# Altium schematic sheet E1811SENSE_0.SchDoc
size B; SheetNumber: 1; SheetTotal: 2
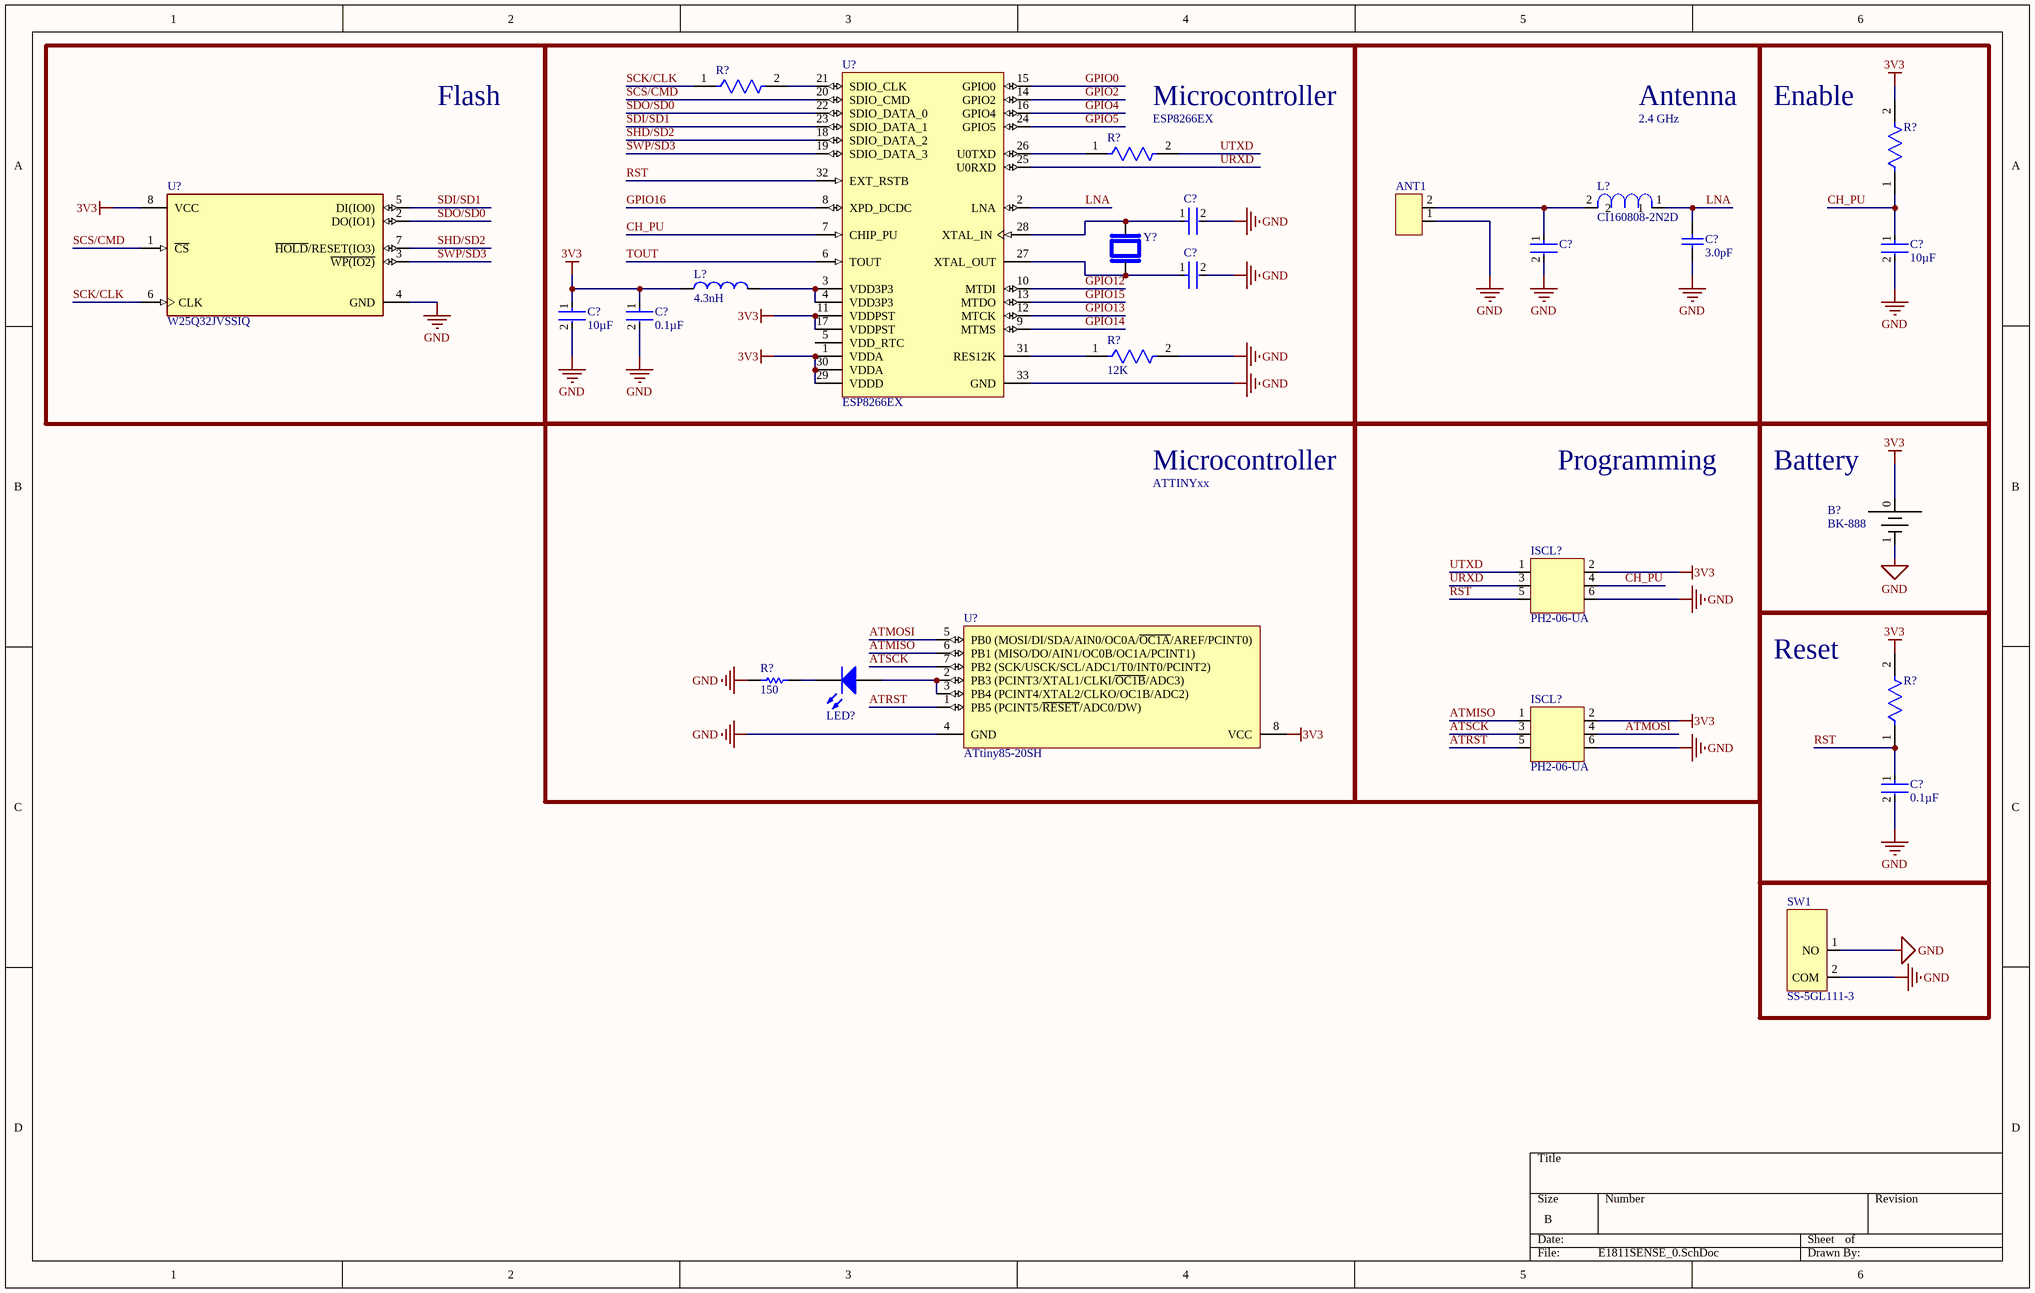
[diagram p0: E1811SENSE_0.SchDoc]

## Parts
(Parts that share a designator on the sheet are numbered #1, #2 ... from top to bottom, then left to right.)
ANT1  2.4GHZ_Antenna  [2.54GHZ_Antenna]  (value not drawn)
B?  BK-888  [BK-888]
C?#1  C0603C689B5GACAUTO  [FP-C0603C-CF-MFG]  (value not drawn)
C?#2  CBR06C249B5GAC  [FP-CBR06C-MFG]  (value not drawn)
C?#3  10µF  [FP-CGB3S-MFG]
C?#4  3.0pF  [CAPC1608X90X35NL10T15]
C?#5  C0603C689B5GACAUTO  [FP-C0603C-CF-MFG]  (value not drawn)
C?#6  10µF  [FP-CGB3S-MFG]
C?#7  0.1µF  [FP-CGA3E-0_3-0_1-MFG]
C?#8  0.1µF  [FP-CGA3E-0_3-0_1-MFG]
ISCL?#1  PH2-06-UA  [PH2-06-UA]
ISCL?#2  PH2-06-UA  [PH2-06-UA]
L?#1  CI160808-2N2D  [INDC1608X08N]
L?#2  4.3nH  [INDC1005X55N]
LED?  L513SRD-A  [L513SRD-A]  (value not drawn)
R?#1  RT0603FRE07200RL  [FP-RT0603-MFG]  (value not drawn)
R?#2  499  [FP-RT0603-MFG]  (value not drawn)
R?#3  AC0603FR-0710KL  [FP-AC0603-MFG]  (value not drawn)
R?#4  12K  [FP-RT0603-MFG]
R?#5  150  [RESC2012N]
R?#6  AC0603FR-0710KL  [FP-AC0603-MFG]  (value not drawn)
SW1  SS-5GL111-3  [SS-5GL1131-3]
U?#1  ESP8266EX  [ESFS-QFN-32_L]
U?#2  W25Q32JVSSIQ  [FP-SS-MFG]
U?#3  ATtiny85-20SH  [8S2_L]
Y?  XRCGB26M000F1H02R0  [OSC_XRCGB26M000F1H02R0]  (value not drawn)

## Blocks framed on the sheet
Flash: U?#2
Microcontroller: C?#1 C?#5-C?#7 L?#2 R?#1 R?#2 R?#4 U?#1 Y?
Antenna: ANT1 C?#2 C?#4 L?#1
Enable: C?#3 R?#3
Microcontroller: LED? R?#5 U?#3
Programming: ISCL?#1 ISCL?#2
Battery: B?
Reset: C?#8 R?#6

## Nets
3V3: B?.0(+) C?#6.1 C?#7.1 ISCL?#1.2 ISCL?#2.2 L?#2.1 R?#3.2 R?#6.2 U?#1.1(VDDA) U?#1.11(VDDPST) U?#1.17(VDDPST) U?#1.29(VDDD) U?#1.30(VDDA) U?#2.8(VCC) U?#3.8(VCC)
GND: ANT1.1 B?.1(Neg) C?#1.2 C?#2.2 C?#3.2 C?#4.1 C?#5.2 C?#6.2 C?#7.2 C?#8.2 ISCL?#1.6 ISCL?#2.6 R?#4.2 R?#5.1 SW1.1(NO) SW1.2(COM) U?#1.33(GND) U?#2.4(GND) U?#3.4(GND)
ATMISO: ISCL?#2.1 U?#3.6(PB1_(MISO/DO/AIN1/OC0B/OC1A/PCINT1))
ATMOSI: ISCL?#2.4 U?#3.5(PB0_(MOSI/DI/SDA/AIN0/OC0A/~{OC1A}/AREF/PCINT0))
ATRST: ISCL?#2.5 U?#3.1(PB5_(PCINT5/~{RESET}/ADC0/DW))
ATSCK: ISCL?#2.3 U?#3.7(PB2_(SCK/USCK/SCL/ADC1/T0/INT0/PCINT2))
CH_PU: C?#3.1 ISCL?#1.4 R?#3.1 U?#1.7(CHIP_PU)
GPIO0: U?#1.15(GPIO0)
GPIO2: U?#1.14(GPIO2)
GPIO4: U?#1.16(GPIO4)
GPIO5: U?#1.24(GPIO5)
GPIO12: U?#1.10(MTDI)
GPIO13: U?#1.12(MTCK)
GPIO14: U?#1.9(MTMS)
GPIO15: U?#1.13(MTDO)
GPIO16: U?#1.8(XPD_DCDC)
LNA: C?#4.2 L?#1.1 U?#1.2(LNA)
RST: C?#8.1 ISCL?#1.5 R?#6.1 U?#1.32(EXT_RSTB)
SCK/CLK: R?#1.1 U?#2.6(CLK)
SCS/CMD: U?#1.20(SDIO_CMD) U?#2.1(~{CS})
SDI/SD1: U?#1.23(SDIO_DATA_1) U?#2.5(DI(IO0))
SDO/SD0: U?#1.22(SDIO_DATA_0) U?#2.2(DO(IO1))
SHD/SD2: U?#1.18(SDIO_DATA_2) U?#2.7(~{HOLD}/RESET(IO3))
SWP/SD3: U?#1.19(SDIO_DATA_3) U?#2.3(~{WP(IO2)})
TOUT: U?#1.6(TOUT)
URXD: ISCL?#1.3 U?#1.25(U0RXD)
UTXD: ISCL?#1.1 R?#2.2
NetANT1_2: ANT1.2 C?#2.1 L?#1.2
NetC?#1_1: C?#1.1 U?#1.28(XTAL_IN) Y?.3
NetC?#5_1: C?#5.1 U?#1.27(XTAL_OUT) Y?.1
NetL?#2_2: L?#2.2 U?#1.3(VDD3P3) U?#1.4(VDD3P3)
NetLED?_1: LED?.1 R?#5.2
NetLED?_2: LED?.2 U?#3.2(PB3_(PCINT3/XTAL1/CLKI/~{OC1B}/ADC3)) U?#3.3(PB4_(PCINT4/XTAL2/CLKO/OC1B/ADC2))
NetR?#1_2: R?#1.2 U?#1.21(SDIO_CLK)
NetR?#2_1: R?#2.1 U?#1.26(U0TXD)
NetR?#4_1: R?#4.1 U?#1.31(RES12K)

Not connected (* = marked no-connect by the designer): U?#1 5(VDD_RTC)

## Notes on the sheet
- (near R?#2) ESP8266EX
- 2.4 GHz
- ATTINYxx

## Library data of the parts
B? = BK-888: BATTERY RETAINER COIN PC PIN; Manufacturer: Memory Protection Devices; Number of Cells: 1; Supplier 1: Digi-Key; Supplier Part Number 1: BK-888-ND; Manufacturer Part Number: BK-888; RoHS: Yes; Category: Uncategorized; Stock 1: 16752; Pricing 1: 1=0.47000, 10=0.39900, 50=0.35040, 100=0.33050, 250=0.30448, 500=0.28612, 1000=0.26775, 2500=0.24327, 5000=0.22644 (USD); Mount: Through Hole,PCB; Package Quantity: 100; Termination: PC Pin; ComponentLink1URL: https://datasheet.ciiva.com/4/bk-888-datasheet-4054.pdf?src-supplier=Digi-Key; ComponentLink1Description: https://datasheet.ciiva.com/4/bk-888-datasheet-4054.pdf?src-supplier=Digi-Key
C?#1 C?#5 = CMP-03020-012605-1: C0603 6.8 pF C0G 30ppm/°C 0.1 pF 50 V; Manufacturer: KEMET; Voltage Rating: 50 V; Tolerance: 0.1 pF; Value: 6.8 pF; Material: Ceramic; Automotive Grade: Grade 1; Temperature Characteristic: C0G; ComponentLink2URL: https://api.kemet.com/component-edge/download/datasheet/C0603C100J5GACAUTO.pdf; Device Class L2: Capacitors; Device Class L1: Passive Components; RoHS: TRUE; Height: 0.87mm; Temperature Coefficient: 30ppm/°C; Octopart: https://octopart.com/c0603c689b5gacauto-kemet-88370509; Temperature: -55°C to +125°C; Temperature Range High: +125°C; Automotive: Yes; Temperature Range Low: -55°C; Device Class L3: Ceramic Capacitors; ComponentLink2Description: Datasheet; Category: Cap; Capacitance: 6.8 pF; Manufacturer Part Number: C0603C689B5GACAUTO; Package: C0603C-CF; Lead Free: Yes
C?#2 = CMP-03020-011865-1: CBR0603 2.4 pF C0G 30ppm/°C 0.1 pF 50 V; Manufacturer: KEMET; Material: Ceramic; Capacitance: 2.4 pF; Value: 2.4 pF; Voltage Rating: 50 V; Tolerance: 0.1 pF; Temperature Characteristic: C0G; Temperature Range Low: -55°C; Device Class L1: Passive Components; Device Class L2: Capacitors; Category: Cap; Height: 0.87mm; Temperature Range High: +125°C; Lead Free: Yes; Device Class L3: Ceramic Capacitors; ComponentLink2Description: Datasheet; Manufacturer Part Number: CBR06C249B5GAC; ComponentLink2URL: https://content.kemet.com/datasheets/KEM_C1030_CBR_SMD.pdf; Octopart: https://octopart.com/cbr06c249b5gac-kemet-84758721; Temperature: -55°C to +125°C; RoHS: TRUE; Temperature Coefficient: 30ppm/°C; Automotive: No; Package: CBR06C; Ipc Land Pattern Name: CAPC16080X80
C?#3 C?#6 = CMP-08246-002672-1: CAP CER 10UF 4V X5R 0603 / CGB3S3X5R0G106M050AB; Tolerance: 20%; Max Operating Temperature: 85°C; Length: 0.063inch; Case Code (Imperial): 0603; RoHS Compliant: Yes; Width: 0.031inch; Thickness: 0.02inch; Voltage Rating: 4V; Min Operating Temperature: -55°C; Mount: Surface Mount; Capacitance: 10uF; Package Quantity: 4000; Case/Package: 0603; Packaging: Tape and Reel; Case Code (Metric): 1608
C?#4 = CMP-2006-02541-1: GRM1885C1H3R0BA01D; Manufacturer: Murata; Part Number: GRM1885C1H3R0BA01D
C?#7 C?#8 = CMP-08246-002186-1: Cap Ceramic 100nF 25V X7R 10% Pad SMD 0603 +125°C Automotive T/R / CGA3E2X7R1E104K080AA; Composition: Ceramic; Dielectric: X7R; Ratings: AEC-Q200; Length: 1.6mm; REACH SVHC: No SVHC; Width: 0.031inch; Packaging: Tape and Reel; Case/Package: 0603; Height: 0.8mm; Termination: SMD/SMT; Max Operating Temperature: 125°C; Thickness: 0.035inch; Case Code (Metric): 1608; Lead Free: Lead Free; Mount: Surface Mount; Voltage Rating (DC): 25V; Capacitance: 100nF; Voltage Rating: 25V; Tolerance: 10%; Weight: 7.1E-05oz; Min Operating Temperature: -55°C; Package Quantity: 1; Depth: 0.8mm; Case Code (Imperial): 0603
L?#1 = CI160808-2N2D: CHIP INDUCTOR, 2.2NH, 300MA 0.3NH, 10GHZ; MF: {'manufacturer': u'Bourns'}; MP: CI160808-2N2D; Price: None; Availability: Unavailable; Package: None; Value: *
L?#2 = MLG1005S4N3ST000: MF: {'manufacturer': u'TDK'}; Package: None; MP: MLG1005S4N3ST000; Value: *; Availability: Unavailable; Price: None
R?#1 = CMP-2000-04682-2: RES SMD 200 OHM 1% 1/10W 0603; Manufacturer: Yageo; Temperature Coefficient: 50 ppm/°C; Tolerance: 0.01; Value: 200Ω; Voltage Rating: 75V; Power Rating: 0.1W; Height: 0.55mm; Automotive: No; ComponentLink2URL: http://www.yageo.com/documents/recent/PYu-RT_1-to-0.01_RoHS_L_9.pdf; Temperature Range High: +155°C; Package: RT0603; Series: RT; Device Class L3: Chip SMD Resistors; ComponentLink2Description: Datasheet; Lead Free: Yes; Octopart: https://octopart.com/rt0603fre07200rl-yageo-1160531; Temperature: -55°C to +155°C; Device Class L2: Resistors; Temperature Range Low: -55°C; RoHS: TRUE; Footprint Url: http://www.yageo.com/exep/pages/download/literatures/PYu-R_Mount_10.pdf; Manufacturer Part Number: RT0603FRE07200RL; Device Class L1: Passive Components; Composition: Thin Film; Ipc Land Pattern Name: RESC16080X45; Category: Res; Digikey Description: RES SMD 200 OHM 1% 1/10W 0603; Mouser Description: Res Thin Film 0603 200 Ohm 1% 0.1W(1/10W) ±50ppm/C Epoxy Pad SMD T/R; Resistance: 200Ω
R?#2 = CMP-03412-028276-1: RES SMD 499 OHM 0.1% 1/10W 0603 / RT0603BRC07499RL; Manufacturer: Yageo; Temperature Coefficient: 15 ppm/°C; Voltage Rating: 75V; Power Rating: 0.1W; Resistance: 499Ω; Value: 499Ω; Tolerance: 0.001; Footprint Url: http://www.yageo.com/exep/pages/download/literatures/PYu-R_Mount_10.pdf; ComponentLink2Description: Datasheet; Series: RT; Height: 0.55mm; Digikey Description: RES SMD 499 OHM 0.1% 1/10W 0603; Manufacturer Part Number: RT0603BRC07499RL; Automotive: No; Octopart: https://octopart.com/rt0603brc07499rl-yageo-71394139; Lead Free: Yes; Temperature Range High: +155°C; Device Class L3: Chip SMD Resistors; ComponentLink2URL: http://www.yageo.com/documents/recent/PYu-RT_1-to-0.01_RoHS_L_9.pdf; Category: Res; Temperature: -55°C to +155°C; Composition: Thin Film; Package: RT0603; Device Class L1: Passive Components; Device Class L2: Resistors; Ipc Land Pattern Name: RESC16080X45; RoHS: TRUE; Temperature Range Low: -55°C
R?#3 R?#6 = CMP-2000-04818-2: RES SMD 10K OHM 1% 1/10W 0603; Manufacturer: Yageo; Value: 10KΩ; Automotive Grade: Grade 0; Tolerance: 0.01; Power Rating: 0.1W; Voltage Rating: 75V; Automotive: Yes; Device Class L2: Resistors; Device Class L1: Passive Components; Footprint Url: http://www.yageo.com/exep/pages/download/literatures/PYu-R_Mount_9.pdf; Temperature Range High: +155°C; Composition: Thick Film; Height: 0.55mm; Series: AC; Mouser Description: Fixed Resistor, Metal Glaze/thick Film, 0.1W, 10000ohm, 50V, 1% +/-Tol, 100ppm/Cel, Surface Mount, 0603; RoHS: TRUE; Manufacturer Part Number: AC0603FR-0710KL; Lead Free: Yes; Package: AC0603; Ipc Land Pattern Name: RESC16080X45; Octopart: https://octopart.com/ac0603fr-0710kl-yageo-21711091; ComponentLink2URL: http://www.yageo.com/NewPortal/yageodocoutput?fileName=/pdf/R-Chip/PYu-AC_51_RoHS_L_6.pdf; Digikey Description: RES SMD 10K OHM 1% 1/10W 0603; Temperature Range Low: -55°C; Temperature: -55°C to +155°C; ComponentLink2Description: Datasheet; Category: Res; Resistance: 10KΩ; Device Class L3: Chip SMD Resistors
R?#4 = CMP-03412-012603-1: RES SMD 12K OHM 1% 1/10W 0603 / RT0603FRE0712KL; Manufacturer: Yageo; Temperature Coefficient: 50 ppm/°C; Value: 12KΩ; Tolerance: 0.01; Power Rating: 0.1W; Voltage Rating: 75V; Temperature Range Low: -55°C; Height: 0.55mm; ComponentLink2Description: Datasheet; Package: RT0603; Composition: Thin Film; Device Class L2: Resistors; Footprint Url: http://www.yageo.com/exep/pages/download/literatures/PYu-R_Mount_10.pdf; Temperature Range High: +155°C; Resistance: 12KΩ; ComponentLink2URL: http://www.yageo.com/documents/recent/PYu-RT_1-to-0.01_RoHS_L_9.pdf; Automotive: No; Digikey Description: RES SMD 12K OHM 1% 1/10W 0603; Device Class L1: Passive Components; Temperature: -55°C to +155°C; Lead Free: Yes; Category: Res; Series: RT; Ipc Land Pattern Name: RESC16080X45; Manufacturer Part Number: RT0603FRE0712KL; Device Class L3: Chip SMD Resistors; RoHS: TRUE; Mouser Description: Thin Film Resistors - SMD 1/10W 12K ohm 1% 50ppm; Octopart: https://octopart.com/rt0603fre0712kl-yageo-40002015
R?#5 = Res_150_0805: RES 150 OHM 1/8W 1% 0805; Manufacturer: Vishay; Manufacturer P/N: CRCW0805150RFKEA; Power Rating: 125mW; Resistance: 150R; Voltage Rating: 150V; Temperature Coefficient: 100ppm/°C; Supplier 1: Digi-Key; Supplier Part Number 1: 541-150CCT-ND; Mount: Surface Mount; Case/Package: 0805; Weight: 0.000194oz; Case Code (Metric): 2012; Case Code (Imperial): 0805; Contact Plating: Tin; Min Operating Temperature: -55°C; Max Operating Temperature: 155°C; Tolerance: 1%; Package Quantity: 10; Composition: Thick Film; Termination: SMD/SMT; Max Power Dissipation: 125mW; Voltage Rating (DC): 150V; Features: Automotive AEC-Q200; Military Standard: Not; Length: 2mm; Height: 0.45mm; Width: 0.049inch; Depth: 1.25mm; Radiation Hardening: No; Lead Free: Lead Free; REACH SVHC: Unknown; ComponentLink3URL: http://www.vishay.com/docs/20035/dcrcwe3.pdf; ComponentLink3Description: http://www.vishay.com/docs/20035/dcrcwe3.pdf
U?#1 = CMP-2000-07453-1: Low-Power, Highly-Integrated Wi-Fi Solution, 2.5 to 3.6 V, 80 mA, -40 to 125 degC, 32-Pin QFN; Manufacturer: Espressif Systems; Mounting Technology: SurfaceMount; Datasheet URL: http://espressif.com/sites/default/files/documentation/0a-esp8266ex_datasheet_en.pdf; Package Reference: QFN-32; Package Description: 32-Pin Quad Falt No-Lead, Body 5 x 5 mm, Pitch 0.5 mm; Manufacturer URL: http://espressif.com; Datasheet Version: Rev. 5.4, 04/2017
U?#2 = CMP-2000-05006-2: IC FLASH 32M SPI 104MHZ 8SOIC; Manufacturer: Winbond; Manufacturer Part Number: W25Q32FVSSIG; Obsolete Part: true; Access Time: 7ns; Nominal Supply Current: 8-20mA; Memory Size: 32Mbits; Max Supply Voltage: 3.6V; Min Supply Voltage: 2.7V; Standoff Height: 0.05mm; Interface: SPI,Other; Package: SS; Memory Type: FLASH; Ipc Land Pattern Name: SOIC127P790X195-8; Temperature Range High: +85°C; Temperature: -40°C to +85°C; Octopart: https://octopart.com/w25q32fvssig-winbond-23896462; Ambient Temperature Range Low: -40°C; Lead Free: Yes; Height: 2.16mm; Automotive: No; Device Class L2: Memory; Digikey Description: IC FLASH 32M SPI 104MHZ 8SOIC; RoHS: TRUE; Frequency: 104MHz; Ambient Temperature Range High: +85°C; ComponentLink2Description: Datasheet; Category: IC; Device Class L1: Integrated Circuits (ICs); Device Class L3: Flash; Temperature Range Low: -40°C; Footprint Url: http://www.winbond.com/resource-files/an0000009%20spiflash%20pcb%20layout%20guideline%20v2.0%2009252017.pdf?__locale=en; ComponentLink2URL: https://www.winbond.com/resource-files/w25q32fv%20revj%2006032016.pdf
U?#3 = CMP-0093-00347-1: 8-bit AVR Microcontroller, 20MHz, 2.7-5.5V, 8K Flash, 512 Bytes EEPROM, 512 Bytes SRAM, Industrial Grade (-40°C to 85°C), 8-Lead SOIC, Pb-Free; ComponentLink3Description: ATtiny25/45/85 Summary; ComponentLink2URL: http://www.atmel.com/dyn/resources/prod_documents/doc2586.pdf; DatasheetVersion: revN, Apr-2011; ComponentLink1URL: http://www.atmel.com/; PackageDescription: 8-Lead, 0.208" Body, Plastic Small Outline Package (EIAJ); ComponentLink1Description: Manufacturer URL; ComponentLink2Description: ATtiny25/45/85 Datasheet; PackageVersion: revF, Apr-2008; PackageReference: 8S2; ComponentLink3URL: http://www.atmel.com/dyn/resources/prod_documents/2586S.pdf
Y? = XRCGB26M000F1H02R0: 27MHz Â±20ppm Crystal 6pF 150 Ohms 4-SMD, No Lead; MF: {'manufacturer': u'Murata Electronics'}; Value: *; MP: XRCGB26M000F1H02R0; Availability: Unavailable; Price: None; Package: None